# EasyEDA schematic ForceSensingBase_Schematics.json
TITLE: Sheet_1; REV: 1.0; Date: 2023-06-11; Sheet: 1/1; Drawn By: schnoog; Company: Your Company
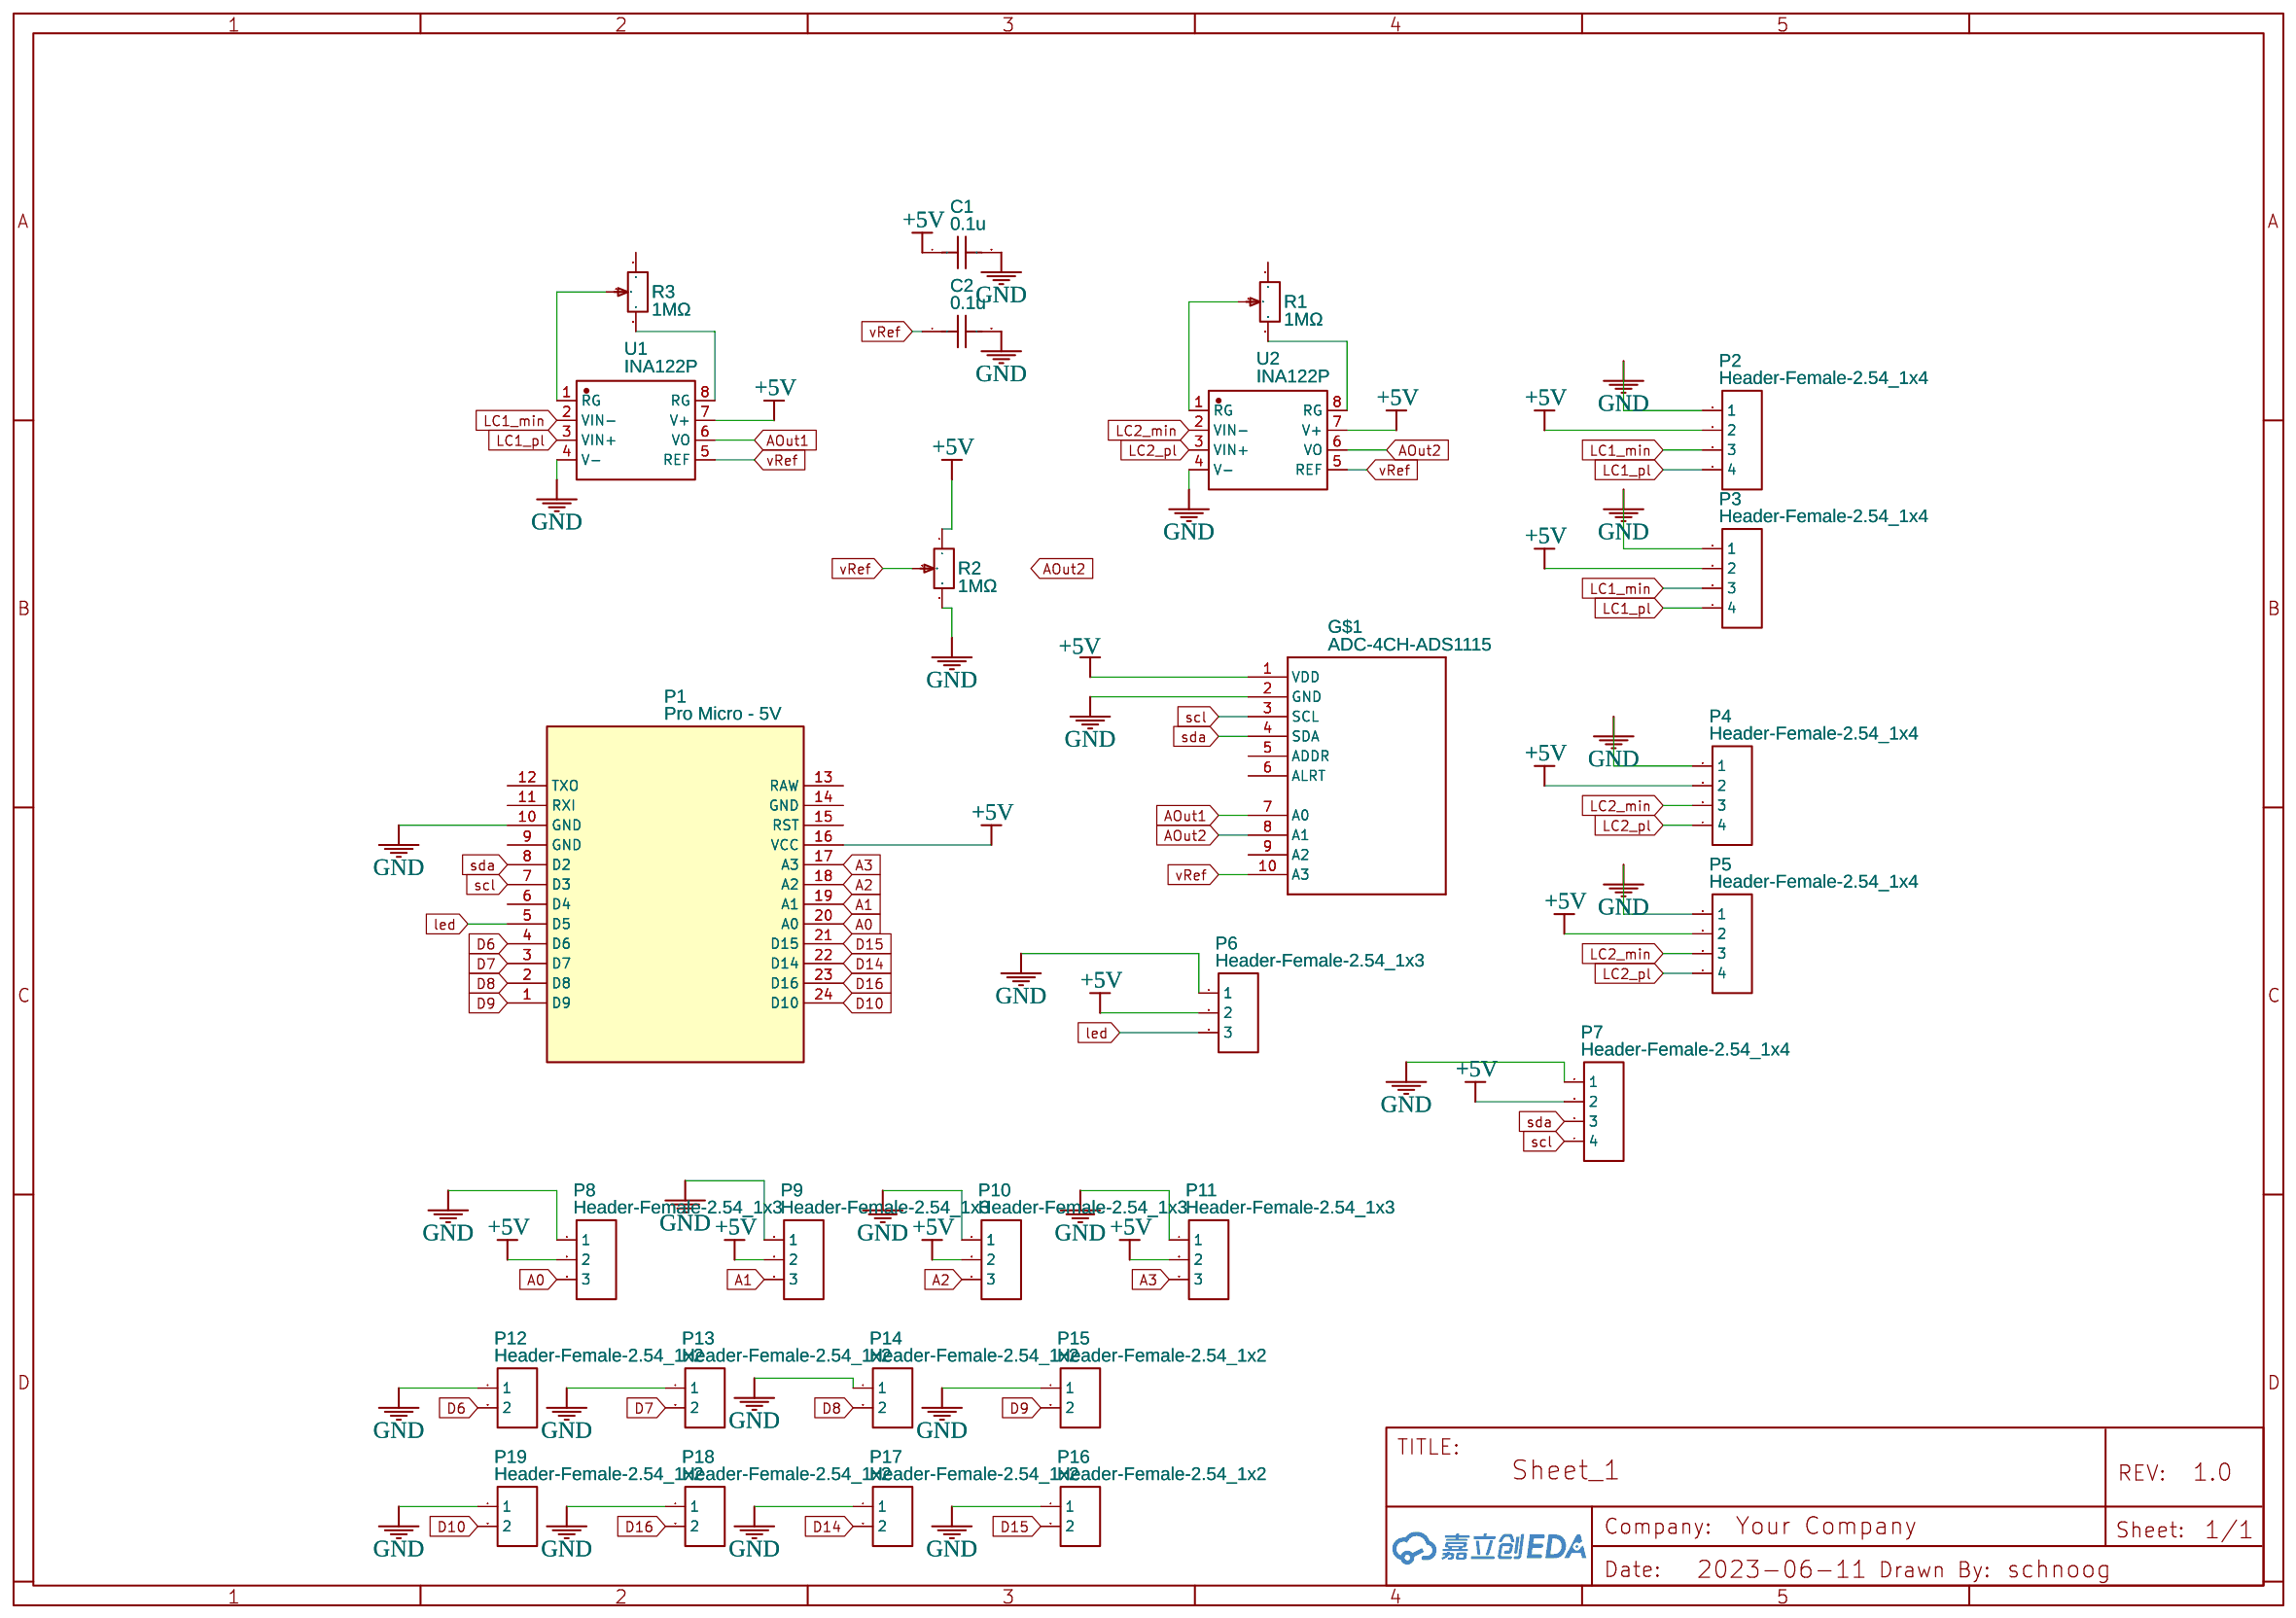
[diagram p0: schematic sheet]

## Parts
C1  0.1u  [C1206]
C2  0.1u  [C1206]
G$1  ADC-4CH-ADS1115  [ADC-4CH-ADS1115]
P1  Pro Micro - 5V  [PRO MICRO - 5V]
P2  Header-Female-2.54_1x4  [HDR-4X1/2.54]
P3  Header-Female-2.54_1x4  [HDR-4X1/2.54]
P4  Header-Female-2.54_1x4  [HDR-4X1/2.54]
P5  Header-Female-2.54_1x4  [HDR-4X1/2.54]
P6  Header-Female-2.54_1x3  [HDR-TH_3P-P2.54-V-F]
P7  Header-Female-2.54_1x4  [HDR-4X1/2.54]
P8  Header-Female-2.54_1x3  [HDR-TH_3P-P2.54-V-F]
P9  Header-Female-2.54_1x3  [HDR-TH_3P-P2.54-V-F]
P10  Header-Female-2.54_1x3  [HDR-TH_3P-P2.54-V-F]
P11  Header-Female-2.54_1x3  [HDR-TH_3P-P2.54-V-F]
P12  Header-Female-2.54_1x2  [HDR-TH_2P-P2.54-V-F]
P13  Header-Female-2.54_1x2  [HDR-TH_2P-P2.54-V-F]
P14  Header-Female-2.54_1x2  [HDR-TH_2P-P2.54-V-F]
P15  Header-Female-2.54_1x2  [HDR-TH_2P-P2.54-V-F]
P16  Header-Female-2.54_1x2  [HDR-TH_2P-P2.54-V-F]
P17  Header-Female-2.54_1x2  [HDR-TH_2P-P2.54-V-F]
P18  Header-Female-2.54_1x2  [HDR-TH_2P-P2.54-V-F]
P19  Header-Female-2.54_1x2  [HDR-TH_2P-P2.54-V-F]
R1  1MΩ  [RES-ADJ-TH_3296W]
R2  1MΩ  [RES-ADJ-TH_3296W]
R3  1MΩ  [RES-ADJ-TH_3296W]
U1  INA122P  [PDIP-8_L9.6-W6.4-P2.54-LS7.6-BL]
U2  INA122P  [PDIP-8_L9.6-W6.4-P2.54-LS7.6-BL]

## Library data of the parts
C1 C2 = C_1206_US: Contributor: LCEDA_Lib
G$1 = ADC-4CH-ADS1115: Contributor: Azias
P1 = Pro Micro - 5V: sourceId: 1T5FDZYC8
P2-P5 P7 = Header-Female-2.54_1x4: Supplier: LCSC; Manufacturer: ReliaPro; Supplier Part: C124413
P6 P8-P11 = Header-Female-2.54_1x3: Supplier Part: C146243; Supplier: LCSC; Manufacturer: BOOMELE(博穆精密); Manufacturer Part: 2.54-1*3P母; link: https://datasheet.lcsc.com/szlcsc/Boom-Precision-Elec-2-54mm-1-8P-Straight-Female-header_C27438.pdf; JLCPCB Part Class: Extended Part
P12-P19 = Header-Female-2.54_1x2: Supplier: LCSC; Manufacturer: BOOMELE(博穆精密); Manufacturer Part: 2.54-1*2P母; Supplier Part: C49661; JLCPCB Part Class: Extended Part
R1-R3 = 3296W-1-105LF: Supplier: LCSC; Manufacturer: BOURNS; Supplier Part: C83687; Resistance(Ohms): 1M; Resistance (Ohms): 1M; JLCPCB Part Class: Extended Part
U1 U2 = INA122P: Supplier: LCSC; Supplier Part: C1346816; Manufacturer: TI(德州仪器); Contributor: LCSC; JLCPCB Part Class: Extended Part

## Nets
+5V: C1.1 G$1.1(VDD) P1.16(VCC) P2.2 P3.2 P4.2 P5.2 P6.2 P7.2 P8.2 P9.2 P10.2 P11.2 R2.1 U1.7(V+) U2.7(V+)
GND: C1.2 C2.2 G$1.2(GND) P1.10(GND) P2.1 P3.1 P4.1 P5.1 P6.1 P7.1 P8.1 P9.1 P10.1 P11.1 P12.1 P13.1 P14.1 P15.1 P16.1 P17.1 P18.1 P19.1 R2.3 U1.4(V-) U2.4(V-)
A0: P1.20(A0) P8.3
A1: P1.19(A1) P9.3
A2: P1.18(A2) P10.3
A3: P1.17(A3) P11.3
AOut1: G$1.7(A0) U1.6(VO)
AOut2: G$1.8(A1) U2.6(VO)
D6: P1.4(D6) P12.2
D7: P1.3(D7) P13.2
D8: P1.2(D8) P14.2
D9: P1.1(D9) P15.2
D10: P1.24(D10) P19.2
D14: P1.22(D14) P17.2
D15: P1.21(D15) P16.2
D16: P1.23(D16) P18.2
LC1_min: P2.3 P3.3 U1.2(VIN-)
LC1_pl: P2.4 P3.4 U1.3(VIN+)
LC2_min: P4.3 P5.3 U2.2(VIN-)
LC2_pl: P4.4 P5.4 U2.3(VIN+)
led: P1.5(D5) P6.3
scl: G$1.3(SCL) P1.7(D3) P7.4
sda: G$1.4(SDA) P1.8(D2) P7.3
vRef: C2.1 G$1.10(A3) R2.2 U1.5(REF) U2.5(REF)
Net-(R1-2): R1.2 U2.1(RG)
Net-(R1-3): R1.3 U2.8(RG)
Net-(R3-2): R3.2 U1.1(RG)
Net-(R3-3): R3.3 U1.8(RG)

Not connected (* = marked no-connect by the designer): G$1 5(ADDR) 6(ALRT) 9(A2); P1 6(D4) 9(GND) 11(RXI) 12(TXO) 13(RAW) 14(GND) 15(RST); R1 1; R3 1
